# EAGLE design rasPiPortExt (EAGLE 6.2)
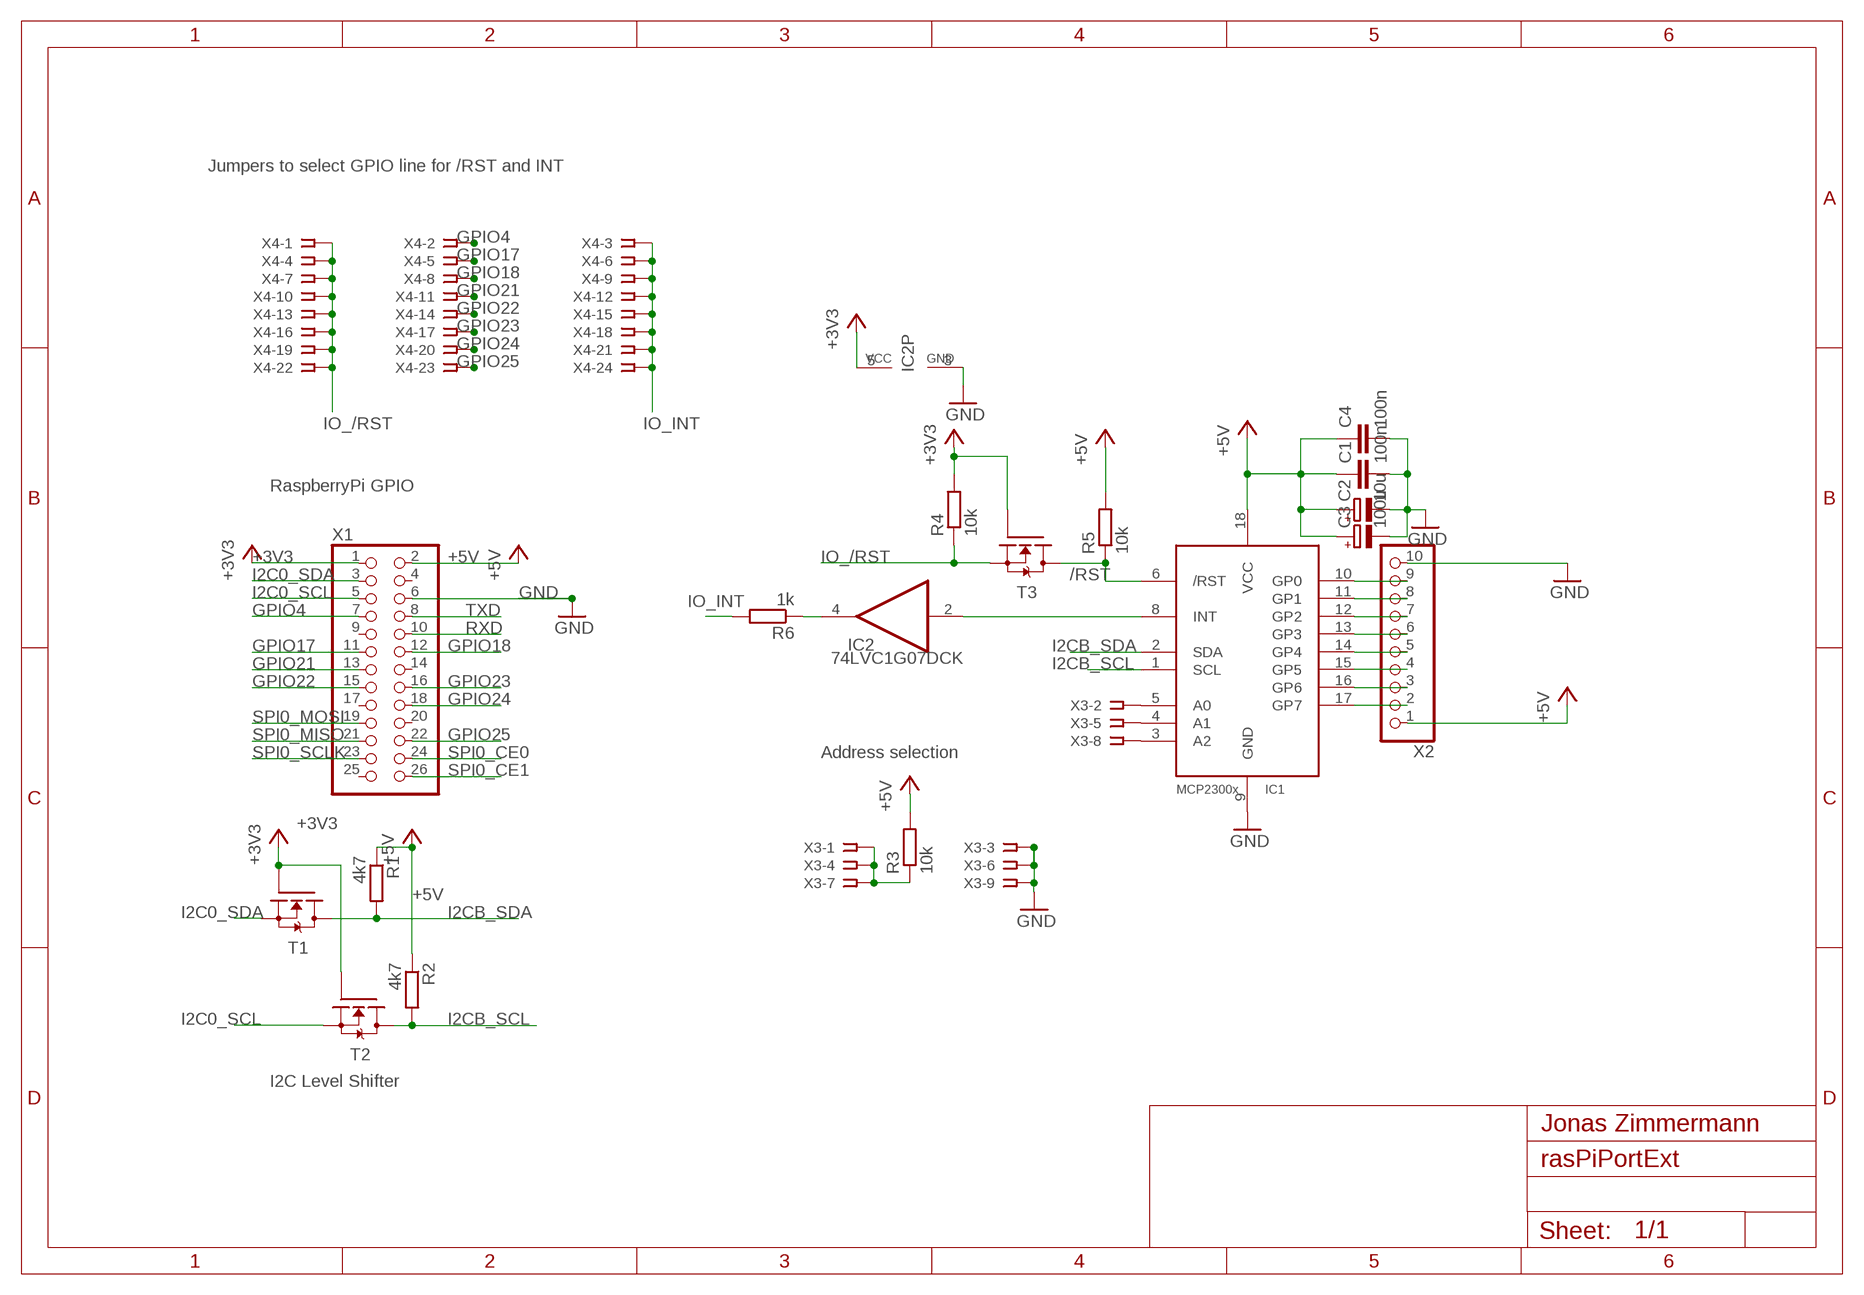
[diagram p0: schematic, sheet 1]

## Parts
C1  100n  C-EUC1206  [C1206]
C2  10u  CPOL-EUC  [PANASONIC_C]
C3  100u  CPOL-EUE2.5-5  [E2,5-5]
C4  100n  C-EU050-025X075  [C050-025X075]
IC1  MCP2300X/P  [DIL18]
IC2  74LVC1G07DCK  [SC70-5]
R1  4k7  R-EU_R0805  [R0805]
R2  4k7  R-EU_R0805  [R0805]
R3  10k  R-EU_R0805  [R0805]
R4  10k  R-EU_R0805  [R0805]
R5  10k  R-EU_R0805  [R0805]
R6  1k  R-EU_R0805  [R0805]
T1  BSS138PW"  [SOT-323]
T2  BSS138PW"  [SOT-323]
T3  BSS138PW"  [SOT-323]
X1  PINHD-2X13  [2X13]
X2  PINHD-1X10  [1X10]
X3  SSW-103-02-S-T  [SSW-103-02-S-T]
X4  SSW-108-02-S-T  [SSW-108-02-S-T]

## Nets
+3V3: IC2.5(VCC) R4.2 T1.P$1(G) T2.P$1(G) T3.P$1(G) X1.1
+5V: C1.1 C2.+ C3.+ C4.1 IC1.18(VCC) R1.1 R2.1 R3.2 R5.2 X1.2 X2.1
/RST: IC1.6(/RST) R5.1 T3.P$3(D)
GND: C1.2 C2.- C3.- C4.2 IC1.9(GND) IC2.3(GND) X1.6 X2.10 X3.3 X3.6 X3.9
GPIO4: X1.7 X4.2
GPIO17: X1.11 X4.5
GPIO18: X1.12 X4.8
GPIO21: X1.13 X4.11
GPIO22: X1.15 X4.14
GPIO23: X1.16 X4.17
GPIO24: X1.18 X4.20
GPIO25: X1.22 X4.23
I2C0_SCL: T2.P$2(S) X1.5
I2C0_SDA: T1.P$2(S) X1.3
I2CB_SCL: IC1.1(SCL) R2.2 T2.P$3(D)
I2CB_SDA: IC1.2(SDA) R1.2 T1.P$3(D)
INT: IC1.8(INT) IC2.2(I)
IO_/RST: R4.1 T3.P$2(S) X4.1 X4.4 X4.7 X4.10 X4.13 X4.16 X4.19 X4.22
IO_INT: R6.2 X4.3 X4.6 X4.9 X4.12 X4.15 X4.18 X4.21 X4.24
N$1: IC1.5(A0) X3.2
N$2: IC1.4(A1) X3.5
N$3: IC1.3(A2) X3.8
N$4: IC1.10(GP0) X2.9
N$5: IC1.11(GP1) X2.8
N$6: IC1.12(GP2) X2.7
N$7: IC1.13(GP3) X2.6
N$8: R3.1 X3.1 X3.4 X3.7
N$9: IC1.14(GP4) X2.5
N$10: IC1.15(GP5) X2.4
N$11: IC1.16(GP6) X2.3
N$12: IC1.17(GP7) X2.2
N$13: IC2.4(O) R6.1
RXD: X1.10
SPI0_CE0: X1.24
SPI0_CE1: X1.26
SPI0_MISO: X1.21
SPI0_MOSI: X1.19
SPI0_SCLK: X1.23
TXD: X1.8
Unconnected: X1.4 X1.9 X1.14 X1.17 X1.20 X1.25

## Notes on the sheet
- Jumpers to select GPIO line for /RST and INT
- RaspberryPi GPIO
- Address selection
- I2C Level Shifter
- Jonas Zimmermann

## Library data of the parts
C1 C4 = resistor:C-EU: CAPACITOR, European symbol
C2 C3 = resistor:CPOL-EU: POLARIZED CAPACITOR, European symbol
IC1 = adafruit:MCP2300X: MCP23008 Inexpensive i2c i/o expander - 8 general purpose i/o pins with optional pullups
IC2 = 74xx-little-us:74*1G07: Single Buffer/Driver With Open-Drain Output
R1-R6 = smdParts:R-EU_: RESISTOR, European symbol
T1-T3 = smdParts:BSS138PW
X1 = pinhead:PINHD-2X13: PIN HEADER
X2 = pinhead:PINHD-1X10: PIN HEADER
X3 = SD:SSW-103-02-S-T
X4 = SD:SSW-108-02-S-T

## Board
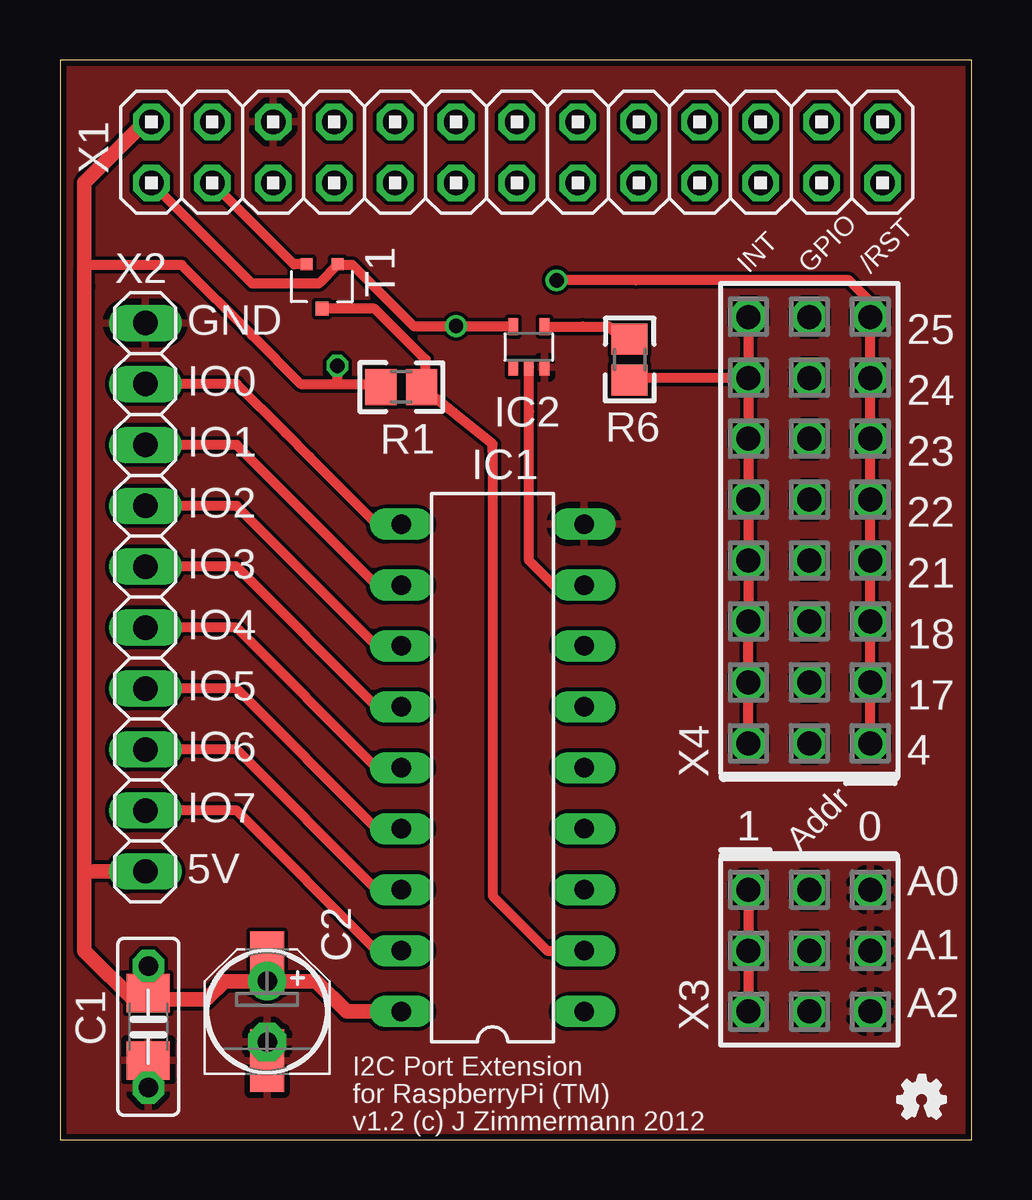
[diagram p1: board, top side]
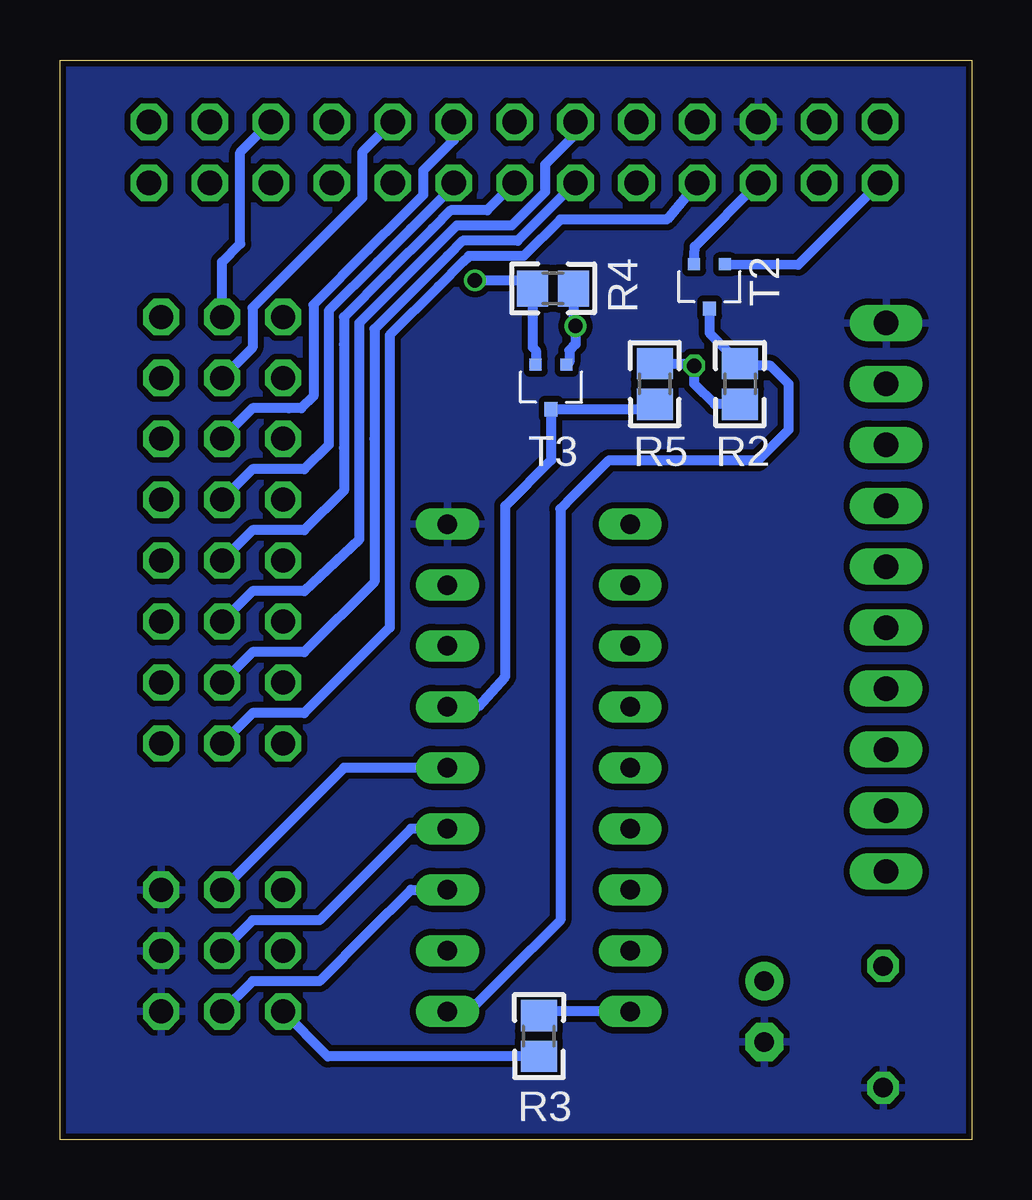
[diagram p2: board, bottom side, seen from below]

Size 38 x 45 mm. Coordinates in mm from the lower left corner, seen from the top.
Outline: 0,0 38,0 38,45 0,45 0,0
Copper layers (1*16): Top 0.035mm / dielectric 1.5mm / Bottom 0.035mm
Design rules: minimum track width 6mil, minimum drill 12mil, track to track 6mil, track to pad 6mil, pad to pad 6mil, via to via 6mil, smd to smd 0mil, copper to edge 10mil, drill to drill 10mil, minimum pad ring 10mil, minimum via ring 6mil, stop-mask expansion 2mil, vias tented up to drill 100mil, thermal gap 10mil

### Footprints (pad centres in the part's own frame; a part is rotated, then mirrored left to right if it is on the bottom)
C1206 = smd 1.6 x 1.8: 1 -1.4,0; 2 1.4,0
PANASONIC_C = smd 2.6 x 1.4: + 2.05,0; - -2.05,0
E2,5-5 = drill 0.813 pad 1.6: + -1.27,0 | drill 0.813 pad 1.6 octagon: - 1.27,0
C050-025X075 = drill 0.813 octagon: 1 -2.54,0; 2 2.54,0
DIL18 = drill 0.813 long: 1 -10.16,-3.81; 2 -7.62,-3.81; 3 -5.08,-3.81; 4 -2.54,-3.81; 5 0,-3.81; 6 2.54,-3.81; 7 5.08,-3.81; 8 7.62,-3.81; 9 10.16,-3.81; 10 10.16,3.81; 11 7.62,3.81; 12 5.08,3.81; 13 2.54,3.81; 14 0,3.81; 15 -2.54,3.81; 16 -5.08,3.81; 17 -7.62,3.81; 18 -10.16,3.81
SC70-5 = smd 0.4 x 0.7: 1 -0.65,-0.85; 2 0,-0.85; 3 0.65,-0.85; 4 0.65,0.85; 5 -0.65,0.85
R0805 = smd 1.3 x 1.5: 1 -0.85,0; 2 0.85,0
SOT-323 = smd 0.5 x 0.5: P$1 -0.65,-0.925; P$2 0.65,-0.925 | smd 0.55 x 0.6: P$3 0,0.925
2X13 = drill 1.016 octagon: 1 -15.24,-1.27; 2 -15.24,1.27; 3 -12.7,-1.27; 4 -12.7,1.27; 5 -10.16,-1.27; 6 -10.16,1.27; 7 -7.62,-1.27; 8 -7.62,1.27; 9 -5.08,-1.27; 10 -5.08,1.27; 11 -2.54,-1.27; 12 -2.54,1.27; 13 0,-1.27; 14 0,1.27; 15 2.54,-1.27; 16 2.54,1.27; 17 5.08,-1.27; 18 5.08,1.27; 19 7.62,-1.27; 20 7.62,1.27; 21 10.16,-1.27; 22 10.16,1.27; 23 12.7,-1.27; 24 12.7,1.27; 25 15.24,-1.27; 26 15.24,1.27
1X10 = drill 1.016 long: 1 -11.43,0; 2 -8.89,0; 3 -6.35,0; 4 -3.81,0; 5 -1.27,0; 6 1.27,0; 7 3.81,0; 8 6.35,0; 9 8.89,0; 10 11.43,0
SSW-103-02-S-T = drill 1 pad 1.5 octagon: 1 -2.54,-2.54; 2 -2.54,0; 3 -2.54,2.54; 4 0,-2.54; 5 0,0; 6 0,2.54; 7 2.54,-2.54; 8 2.54,0; 9 2.54,2.54
SSW-108-02-S-T = drill 1 pad 1.5 octagon: 1 -8.89,-2.54; 2 -8.89,0; 3 -8.89,2.54; 4 -6.35,-2.54; 5 -6.35,0; 6 -6.35,2.54; 7 -3.81,-2.54; 8 -3.81,0; 9 -3.81,2.54; 10 -1.27,-2.54; 11 -1.27,0; 12 -1.27,2.54; 13 1.27,-2.54; 14 1.27,0; 15 1.27,2.54; 16 3.81,-2.54; 17 3.81,0; 18 3.81,2.54; 19 6.35,-2.54; 20 6.35,0; 21 6.35,2.54; 22 8.89,-2.54; 23 8.89,0; 24 8.89,2.54

### Placement (x,y rotation side)
C1  3.68,4.7 270 top
C2  8.64,5.33 90 top
C3  8.64,5.33 270 top
C4  3.68,4.7 270 top
IC1  18.03,15.49 90 top
IC2  19.55,33.04 0 top
R1  14.22,31.37 0 top
R2  9.65,31.5 90 bottom
R3  18.03,4.32 90 bottom
R4  17.45,35.48 0 bottom
R5  13.21,31.5 90 bottom
R6  23.75,32.51 270 top
T1  10.92,35.56 180 top
T2  10.92,35.56 180 bottom
T3  17.53,31.37 180 bottom
U$1  [OSHW_FILLX70_NOTEXT]  34.92,0.89 0 top
X1  19.05,41.15 0 top
X2  3.56,22.61 90 top
X3  31.24,7.87 270 top
X4  31.24,25.4 90 top

### Tracks (layer width: path | path; a pad name or v marks a point on that pad's centre or on a via)
+3V3  (via drill 0.6)
  Top 0.406: X1.1 5.59,38.1 7.87,35.81 8,35.69 10.79,35.69 11.57,36.46 T1.P$1 11.61,36.45 12.19,36.45 14.73,33.91 v16.51,33.91 18.88,33.91 IC2.5
  Bottom 0.406: T2.P$1 7.22,36.47 5.46,38.23 X1.1 | T3.P$1 16.76,32.41 16.76,32.89 16.51,33.15 v16.51,33.91 16.6,34 R4.2
+5V  (via drill 0.6)
  Top 0.406: C1.1 3.81,5.71 | 3.81,5.71 4.06,5.84 | 3.81,5.71 3.17,5.71 | 1.4,11.18 1.02,11.18 | C4.1 3.68,5.71 | 1.02,36.58 1.14,36.45 5.08,36.45 8,33.53 10.03,31.5 11.43,31.5 | 12.08,5.33 11.94,5.33 | 11.43,31.5 13.25,31.5 R1.1 | v11.56,32.26 11.56,31.62 11.43,31.5 | C3.+ C2.+ C3.+
  Top 0.61: X1.2 3.56,42.42 1.02,39.88 1.02,36.58 1.02,36.32 1.02,35.56 1.02,11.18 1.02,7.87 3.17,5.71 3.68,5.71 | 4.06,5.84 6.1,5.84 6.86,6.6 C3.+ 10.67,6.6 11.94,5.33 | 12.08,5.33 IC1.18 | X2.1 1.4,11.18
  Bottom 0.406: IC1.18 17.87,5.33 R3.2 | R5.2 11.64,32.35 v11.56,32.26 11.56,31.5 10.71,30.65 R2.1
/RST
  Bottom 0.406: IC1.6 20.57,18.03 19.43,19.3 19.43,26.42 17.53,28.32 T3.P$3 13.41,30.44 R5.1
GND
  pour Top: 0,45 38,45 38,0 0,0
  pour Bottom (isolate 0.254): 0,0 38,0 38,45 0,45
GPIO4
  Bottom 0.406: X1.7 12.7,38.35 14.73,38.35 17.14,38.35 18.67,36.83 20.95,36.83 21.21,36.58 22.23,35.56 24.26,33.53 24.26,28.83 24.26,21.34 27.81,17.78 29.97,17.78 X4.2
GPIO17
  Bottom 0.406: X1.11 18.92,37.47 21.21,37.47 21.84,36.83 23.75,34.92 24.89,33.78 24.89,29.21 24.89,23.24 27.81,20.32 29.97,20.32 X4.5
GPIO18
  Bottom 0.406: X1.12 16.51,41.91 17.78,40.64 17.78,39.5 19.18,38.1 21.46,38.1 22.61,36.96 24,35.56 25.53,34.04 25.53,28.7 25.53,25.02 27.81,22.86 29.97,22.86 X4.8
GPIO21
  Bottom 0.406: X1.13 20.19,38.73 21.72,38.73 22.48,37.97 24.38,36.07 26.16,34.29 26.16,33.15 26.16,28.83 26.16,27.05 27.81,25.4 29.97,25.4 X4.11
GPIO22
  Bottom 0.406: X1.15 21.72,39.62 23.37,37.97 24.77,36.58 26.8,34.54 26.8,29.34 26.8,28.96 27.81,27.94 29.97,27.94 X4.14
GPIO23
  Bottom 0.406: X1.16 21.59,41.66 22.86,40.39 22.86,39.37 23.75,38.48 25.15,37.08 27.43,34.8 27.43,30.99 27.94,30.48 28.45,30.48 29.97,30.48 X4.17
GPIO24
  Bottom 0.406: X1.18 25.4,41.15 25.4,39.24 27.94,36.7 28.19,36.45 29.97,34.67 29.97,33.02 X4.20
GPIO25
  Bottom 0.406: X4.23 31.24,36.58 30.48,37.34 30.48,41.15 X1.22
I2C0_SCL
  Bottom 0.406: T2.P$2 11.54,37.23 X1.5
I2C0_SDA
  Top 0.406: T1.P$2 9.74,36.48 X1.3
I2CB_SCL
  Bottom 0.406: IC1.1 20.95,5.33 19.56,6.73 17.14,9.14 17.14,26.29 16.64,26.8 15.11,28.32 8.89,28.32 7.62,29.59 7.62,31.5 8.38,32.26 9.56,32.26 R2.2 10.92,33.62 T2.P$3
I2CB_SDA
  Top 0.406: IC1.2 20.32,7.87 18.03,10.16 18.03,11.81 18.03,28.66 18.03,28.98 R1.2 15.24,31.77 15.24,32.51 13.12,34.63 T1.P$3
INT
  Top 0.406: IC1.8 20.57,23.11 19.56,24.13 19.56,30.35 19.56,32.18 IC2.2
IO_/RST  (via drill 0.6)
  Top 0.406: X4.1 X4.4 X4.7 X4.10 X4.13 X4.16 X4.19 X4.22 33.78,34.92 32.89,35.81 24,35.81 v20.7,35.81
  Bottom 0.406: 18.85,35.81 18.87,35.79 R4.1 | v20.7,35.81 18.95,35.81 R4.1 | R4.1 18.3,33.03 18.16,32.89 18.16,32.31 T3.P$2
IO_INT
  Top 0.406: X4.24 X4.21 | X4.21 X4.18 X4.15 X4.12 28.7,23.11 X4.9 X4.6 X4.3 | X4.21 24.41,31.75 R6.2
N$1
  Bottom 0.406: IC1.5 26.16,15.49 X3.2
N$2
  Bottom 0.406: IC1.4 23.37,12.95 27.18,9.14 29.97,9.14 X3.5
N$3
  Bottom 0.406: X3.8 29.97,6.6 27.18,6.6 25.15,8.64 23.37,10.41 IC1.3
N$4
  Top 0.406: IC1.10 13.21,25.65 10.41,28.45 9.4,29.46 7.37,31.5 X2.9
N$5
  Top 0.406: IC1.11 13.21,23.11 7.37,28.96 X2.8
N$6
  Top 0.406: IC1.12 13.21,20.57 7.37,26.42 X2.7
N$7
  Top 0.406: IC1.13 13.21,18.03 7.37,23.88 X2.6
N$8
  Top 0.406: X3.1 28.7,10.16 X3.4 X3.7
  Bottom 0.406: R3.1 26.84,3.47 X3.7
N$9
  Top 0.406: IC1.14 13.21,15.49 7.37,21.34 X2.5
N$10
  Top 0.406: IC1.15 13.21,12.95 7.37,18.8 X2.4
N$11
  Top 0.406: IC1.16 13.21,10.41 7.37,16.26 X2.3
N$12
  Top 0.406: IC1.17 13.21,7.87 7.37,13.72 X2.2
N$13
  Top 0.406: IC2.4 21.8,33.89 22.88,33.89 23.24,33.53 23.58,33.53 R6.1

### Text on the board
tPlace: INT | GPIO | /RST | GND | 25 | IO0 | 24 | IO1 | 23 | IO2 | 22 | IO3 | 21 | IO4 | 18 | IO5 | 17 | IO6 | 4 | IO7 | 1 | Addr | 0 | 5V | A0 | A1 | A2 | I2C Port Extension | for RaspberryPi (TM) | v1.2 (c) J Zimmermann 2012